# Altium project OSV.PrjPcb
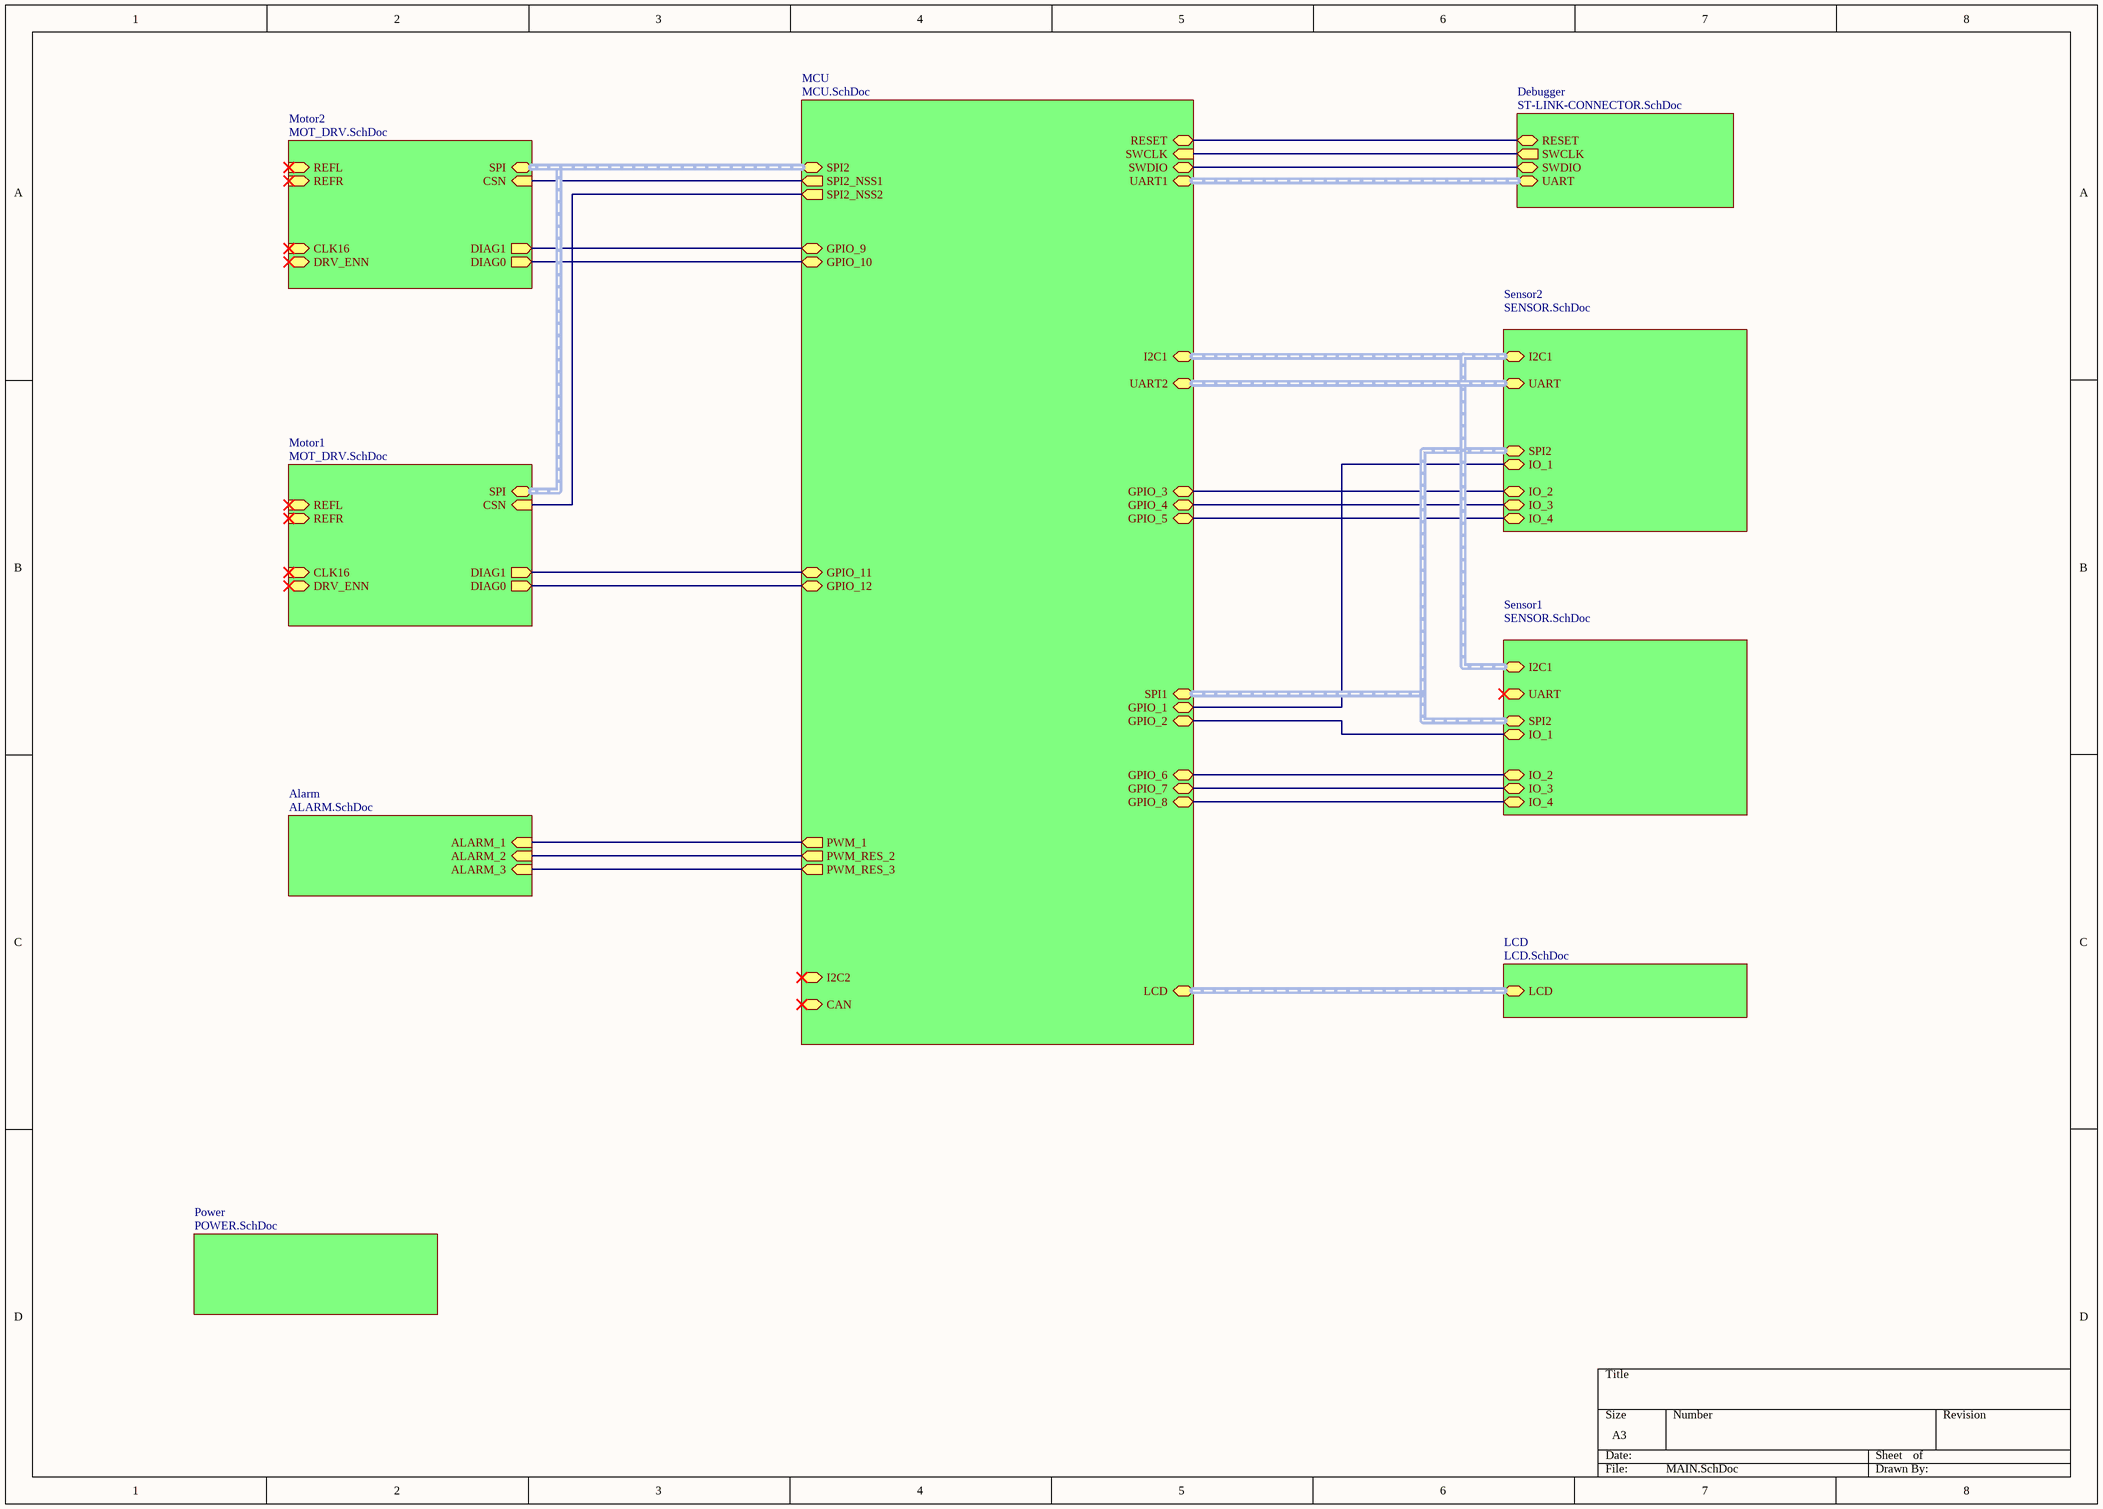
[diagram p0: MAIN.SchDoc]
8 sheets, 34 parts. Net scope: hierarchical (ports join the sheet entries above them; power ports are global).
Board file: MOTHERBOARD.PcbDoc
Sheets:
  MAIN.SchDoc
    MCU = MCU.SchDoc
    Motor2 = MOT_DRV.SchDoc
    Motor1 = MOT_DRV.SchDoc
    Alarm = ALARM.SchDoc
    LCD = LCD.SchDoc
    Debugger = ST-LINK-CONNECTOR.SchDoc
    Sensor1 = SENSOR.SchDoc
    Sensor2 = SENSOR.SchDoc
    Power = POWER.SchDoc

## Sheet MAIN.SchDoc
size A3

### Sub-sheets
Alarm = ALARM.SchDoc: ALARM_3 (in), ALARM_1 (in), ALARM_2 (in)
Debugger = ST-LINK-CONNECTOR.SchDoc: SWDIO (bidir), SWCLK (out), RESET, UART (harness UART)
LCD = LCD.SchDoc: LCD (harness LCD)
MCU = MCU.SchDoc: UART1 (harness UART), UART2 (harness UART), GPIO_7, CAN (harness CAN), GPIO_1, GPIO_5, RESET, SWCLK (in), GPIO_2, SWDIO (bidir), SPI2 (harness SPI), SPI1 (harness SPI), GPIO_6, GPIO_12, GPIO_3, GPIO_9, I2C1 (harness I2C), I2C2 (harness I2C), GPIO_11, LCD (harness LCD), GPIO_8, GPIO_4, GPIO_10, PWM_1 (out), PWM_RES_2 (out), PWM_RES_3 (out), SPI2_NSS1 (out), SPI2_NSS2 (out)
Motor1 = MOT_DRV.SchDoc: DRV_ENN, DIAG1 (out), REFR (in), DIAG0 (out), CLK16 (in), REFL (in), CSN (in), SPI (harness SPI)
Motor2 = MOT_DRV.SchDoc: DRV_ENN, DIAG1 (out), REFR (in), DIAG0 (out), CLK16 (in), REFL (in), CSN (in), SPI (harness SPI)
Power = POWER.SchDoc: no entries
Sensor1 = SENSOR.SchDoc: I2C1 (harness I2C), UART (harness UART), SPI2 (harness SPI), IO_2, IO_1, IO_3, IO_4
Sensor2 = SENSOR.SchDoc: I2C1 (harness I2C), UART (harness UART), SPI2 (harness SPI), IO_2, IO_1, IO_3, IO_4

### Nets
CSN: sheet MCU/SPI2_NSS1, sheet Motor2/CSN
CSN: sheet MCU/SPI2_NSS2, sheet Motor1/CSN  [a separate net that carries the same name]
DIAG0: sheet MCU/GPIO_12, sheet Motor1/DIAG0
DIAG0: sheet MCU/GPIO_10, sheet Motor2/DIAG0  [a separate net that carries the same name]
DIAG1: sheet MCU/GPIO_9, sheet Motor2/DIAG1
DIAG1: sheet MCU/GPIO_11, sheet Motor1/DIAG1  [a separate net that carries the same name]
GPIO_1: sheet MCU/GPIO_1, sheet Sensor2/IO_1
GPIO_2: sheet MCU/GPIO_2, sheet Sensor1/IO_1
GPIO_3: sheet MCU/GPIO_3, sheet Sensor2/IO_2
GPIO_4: sheet MCU/GPIO_4, sheet Sensor2/IO_3
GPIO_5: sheet MCU/GPIO_5, sheet Sensor2/IO_4
GPIO_6: sheet MCU/GPIO_6, sheet Sensor1/IO_2
GPIO_7: sheet MCU/GPIO_7, sheet Sensor1/IO_3
GPIO_8: sheet MCU/GPIO_8, sheet Sensor1/IO_4
NRST: sheet MCU/RESET, sheet Debugger/RESET
SWCLK: sheet MCU/SWCLK, sheet Debugger/SWCLK
SWDIO: sheet MCU/SWDIO, sheet Debugger/SWDIO
TIM1_CH1: sheet MCU/PWM_1, sheet Alarm/ALARM_1
TIM1_CH2: sheet MCU/PWM_RES_2, sheet Alarm/ALARM_2
TIM1_CH3: sheet MCU/PWM_RES_3, sheet Alarm/ALARM_3

### Buses and harness runs
harness sheet Debugger/UART = sheet MCU/UART1
harness sheet LCD/LCD = sheet MCU/LCD
harness sheet MCU/I2C1 = sheet Sensor1/I2C1 = sheet Sensor2/I2C1
harness sheet MCU/SPI1 = sheet Sensor1/SPI2 = sheet Sensor2/SPI2
harness sheet MCU/SPI2 = sheet Motor1/SPI = sheet Motor2/SPI
harness sheet MCU/UART2 = sheet Sensor2/UART

## Sheet MCU.SchDoc: MCU STM32H750VBT
size A3; Author: Ahmad Banshee; DrawnBy: Ahmad Banshee
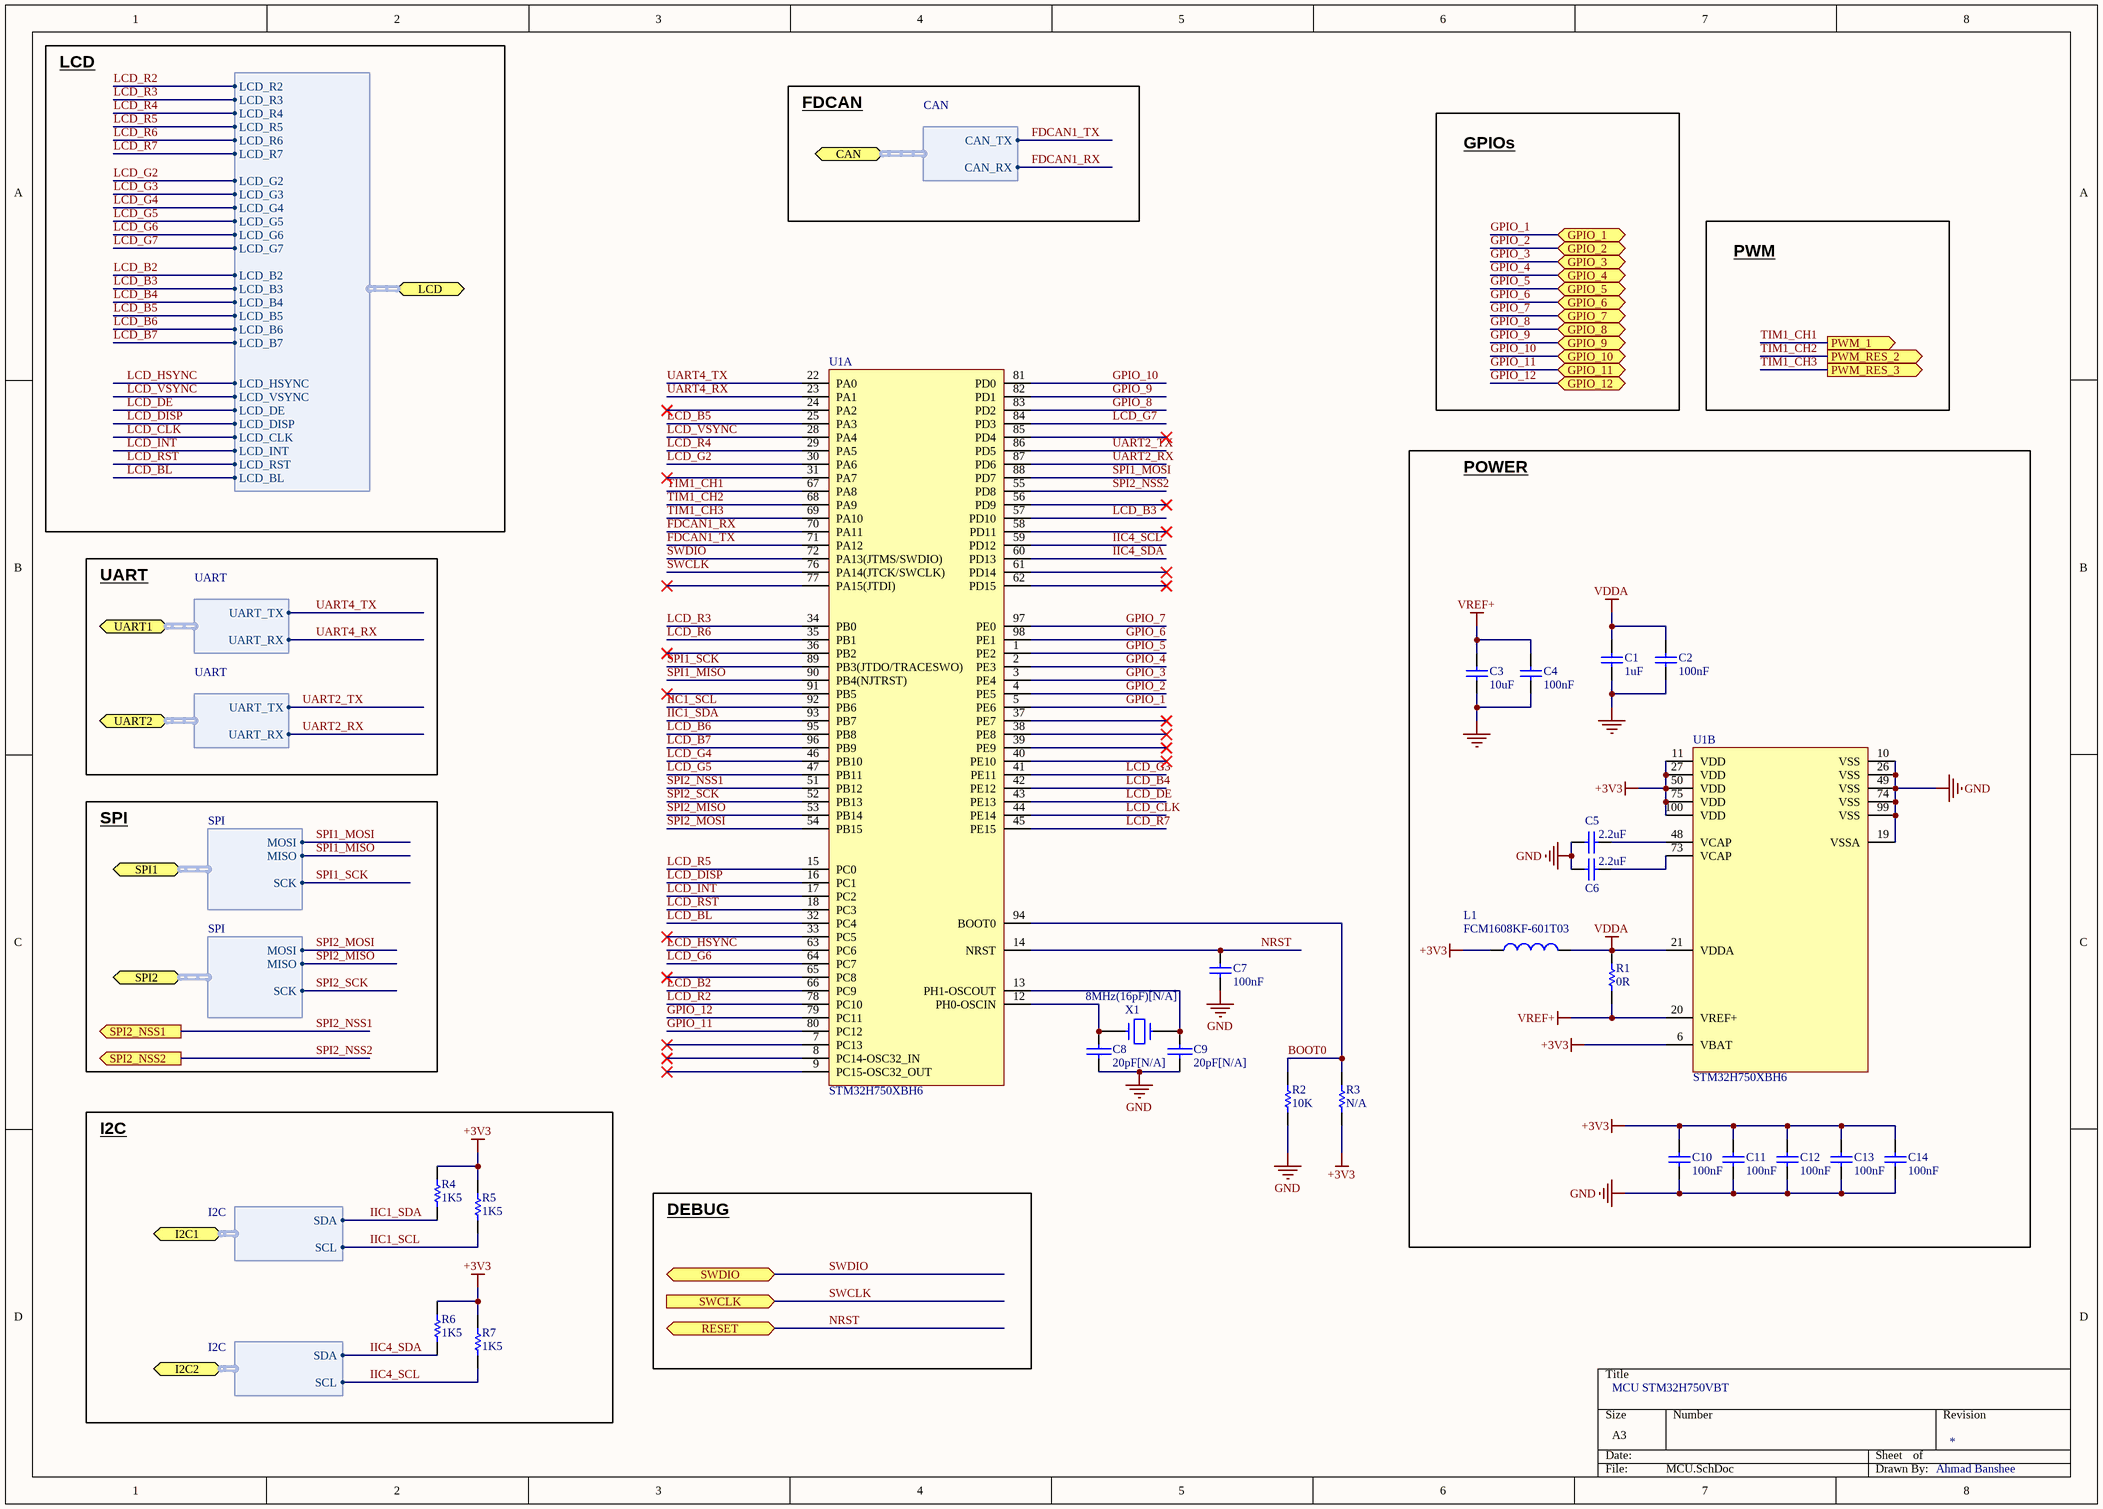
[diagram p1: MCU.SchDoc]

### Parts
C1  value 1uF  [0805C-ST]  (hidden comment: Capacitor)
C2  value 100nF  [0603C ST]  (hidden comment: Capacitor)
C3  value 10uF  [0805C-ST]  (hidden comment: Capacitor)
C4  value 100nF  [0603C ST]  (hidden comment: Capacitor)
C5  value 2.2uF  [0603C-ST]  (hidden comment: Capacitor)
C6  value 2.2uF  [0603C-ST]  (hidden comment: Capacitor)
C7  100nF  [0603C ST]
C8  20pF[N/A]  [0603C ST]
C9  20pF[N/A]  [0603C ST]
C10  value 100nF  [0603C ST]  (hidden comment: Capacitor)
C11  value 100nF  [0603C ST]  (hidden comment: Capacitor)
C12  value 100nF  [0603C ST]  (hidden comment: Capacitor)
C13  value 100nF  [0603C ST]  (hidden comment: Capacitor)
C14  value 100nF  [0603C ST]  (hidden comment: Capacitor)
L1  Manufacturer_Part_Number: FCM1608KF-601T03  [0603L-ST]  (hidden comment: BEAD)
R1  value 0R  [0603R]  (hidden comment: Resistor)
R2  value 10K  [0603R]  (hidden comment: Resistor)
R3  N/A  [0603R]
R4  value 1K5  [0603R]  (hidden comment: Resistor)
R5  value 1K5  [0603R]  (hidden comment: Resistor)
R6  value 1K5  [0603R]  (hidden comment: Resistor)
R7  value 1K5  [0603R]  (hidden comment: Resistor)
U1  value STM32H750XBH6  [LQFP100_M]  (parts A,B of 2)
X1  8MHz(16pF)[N/A]  [XTAL1]

### Blocks framed on the sheet
POWER: C1-C6 C10-C14 L1 R1 U1
I2C: R4-R7

### Ports
CAN (harness CAN), GPIO_1, GPIO_2, GPIO_3, GPIO_4, GPIO_5, GPIO_6, GPIO_7, GPIO_8, GPIO_9, GPIO_10, GPIO_11, GPIO_12, I2C1 (harness I2C), I2C2 (harness I2C), LCD (harness LCD), PWM_1 (out), PWM_RES_2 (out), PWM_RES_3 (out), RESET, SPI1 (harness SPI), SPI2 (harness SPI), SPI2_NSS1 (out), SPI2_NSS2 (out), SWCLK (in), SWDIO (bidir), UART1 (harness UART), UART2 (harness UART)

### Harnesses
I2C: SDA, SCL
UART: UART_TX, UART_RX
SPI: MOSI, MISO, SCK
CAN: CAN_TX, CAN_RX
LCD: LCD_R2, LCD_G2, LCD_B2, LCD_HSYNC, LCD_VSYNC, LCD_DE, LCD_DISP, LCD_CLK, LCD_INT, LCD_BL, LCD_RST, LCD_R3, LCD_R4, LCD_R5, LCD_R6, LCD_R7, LCD_G3, LCD_G4, LCD_G5, LCD_G6, LCD_G7, LCD_B3, LCD_B4, LCD_B5, LCD_B6, LCD_B7

### Nets
+3V3: C10.2 C11.2 C12.2 C13.2 C14.2 L1.1 R3.1 R4.2 R5.2 R6.2 R7.2 U1.6(VBAT) U1.11(VDD) U1.27(VDD) U1.50(VDD) U1.75(VDD) U1.100(VDD)
GND: C1.1 C2.1 C3.1 C4.1 C5.1 C6.1 C7.2 C8.1 C9.1 C10.1 C11.1 C12.1 C13.1 C14.1 R2.2 U1.10(VSS) U1.19(VSSA) U1.26(VSS) U1.49(VSS) U1.74(VSS) U1.99(VSS)
VDDA: C1.2 C2.2 L1.2 R1.1 U1.21(VDDA)
VREF+: C3.2 C4.2 R1.2 U1.20(VREF+)
BOOT0: R2.1 R3.2 U1.94(BOOT0)
FDCAN1_RX: U1.70(PA11) ; port CAN.CAN_RX
FDCAN1_TX: U1.71(PA12) ; port CAN.CAN_TX
GPIO_1: U1.5(PE6) ; port GPIO_1
GPIO_2: U1.4(PE5) ; port GPIO_2
GPIO_3: U1.3(PE4) ; port GPIO_3
GPIO_4: U1.2(PE3) ; port GPIO_4
GPIO_5: U1.1(PE2) ; port GPIO_5
GPIO_6: U1.98(PE1) ; port GPIO_6
GPIO_7: U1.97(PE0) ; port GPIO_7
GPIO_8: U1.83(PD2) ; port GPIO_8
GPIO_9: U1.82(PD1) ; port GPIO_9  [project net DIAG1]
GPIO_10: U1.81(PD0) ; port GPIO_10  [project net DIAG0]
GPIO_11: U1.80(PC12) ; port GPIO_11  [project net DIAG1]
GPIO_12: U1.79(PC11) ; port GPIO_12  [project net DIAG0]
IIC1_SCL: R5.1 U1.92(PB6) ; port I2C1.SCL
IIC1_SDA: R4.1 U1.93(PB7) ; port I2C1.SDA
IIC4_SCL: R7.1 U1.59(PD12) ; port I2C2.SCL
IIC4_SDA: R6.1 U1.60(PD13) ; port I2C2.SDA
LCD_B2: U1.66(PC9) ; port LCD.LCD_B2
LCD_B3: U1.57(PD10) ; port LCD.LCD_B3
LCD_B4: U1.42(PE12) ; port LCD.LCD_B4  [project net A_LCD]
LCD_B5: U1.25(PA3) ; port LCD.LCD_B5  [project net K_LCD]
LCD_B6: U1.95(PB8) ; port LCD.LCD_B6  [project net CANCEL]
LCD_B7: U1.96(PB9) ; port LCD.LCD_B7
LCD_BL: U1.32(PC4) ; port LCD.LCD_BL
LCD_CLK: U1.44(PE14) ; port LCD.LCD_CLK
LCD_DE: U1.43(PE13) ; port LCD.LCD_DE
LCD_DISP: U1.16(PC1) ; port LCD.LCD_DISP
LCD_G2: U1.30(PA6) ; port LCD.LCD_G2
LCD_G3: U1.41(PE11) ; port LCD.LCD_G3  [project net A0_LCD]
LCD_G4: U1.46(PB10) ; port LCD.LCD_G4
LCD_G5: U1.47(PB11) ; port LCD.LCD_G5  [project net CS_LCD]
LCD_G6: U1.64(PC7) ; port LCD.LCD_G6
LCD_G7: U1.84(PD3) ; port LCD.LCD_G7  [project net ADD]
LCD_HSYNC: U1.63(PC6) ; port LCD.LCD_HSYNC
LCD_INT: U1.17(PC2) ; port LCD.LCD_INT
LCD_R2: U1.78(PC10) ; port LCD.LCD_R2
LCD_R3: U1.34(PB0) ; port LCD.LCD_R3
LCD_R4: U1.29(PA5) ; port LCD.LCD_R4
LCD_R5: U1.15(PC0) ; port LCD.LCD_R5  [project net I:E]
LCD_R6: U1.35(PB1) ; port LCD.LCD_R6
LCD_R7: U1.45(PE15) ; port LCD.LCD_R7
LCD_RST: U1.18(PC3) ; port LCD.LCD_RST
LCD_VSYNC: U1.28(PA4) ; port LCD.LCD_VSYNC
NRST: C7.1 U1.14(NRST) ; port RESET
SPI1_MISO: U1.90(PB4(NJTRST)) ; port SPI1.MISO
SPI1_MOSI: U1.88(PD7) ; port SPI1.MOSI
SPI1_SCK: U1.89(PB3(JTDO/TRACESWO)) ; port SPI1.SCK
SPI2_MISO: U1.53(PB14) ; port SPI2.MISO  [project net SDO]
SPI2_MOSI: U1.54(PB15) ; port SPI2.MOSI  [project net SDI]
SPI2_NSS1: U1.51(PB12) ; port SPI2_NSS1  [project net CSN]
SPI2_NSS2: U1.55(PD8) ; port SPI2_NSS2  [project net CSN]
SPI2_SCK: U1.52(PB13) ; port SPI2.SCK  [project net SCK]
SWCLK: U1.76(PA14(JTCK/SWCLK)) ; port SWCLK
SWDIO: U1.72(PA13(JTMS/SWDIO)) ; port SWDIO
TIM1_CH1: U1.67(PA8) ; port PWM_1
TIM1_CH2: U1.68(PA9) ; port PWM_RES_2
TIM1_CH3: U1.69(PA10) ; port PWM_RES_3
UART2_RX: U1.87(PD6) ; port UART2.UART_RX
UART2_TX: U1.86(PD5) ; port UART2.UART_TX
UART4_RX: U1.23(PA1) ; port UART1.UART_RX
UART4_TX: U1.22(PA0) ; port UART1.UART_TX
NetC5_2: C5.2 U1.48(VCAP)
NetC6_2: C6.2 U1.73(VCAP)
NetC8_2: C8.2 U1.12(PH0-OSCIN) X1.1
NetC9_2: C9.2 U1.13(PH1-OSCOUT) X1.2

Not connected (* = marked no-connect by the designer): U1 7(PC13)* 8(PC14-OSC32_IN)* 9(PC15-OSC32_OUT)* 24(PA2)* 31(PA7)* 33(PC5)* 36(PB2)* 37(PE7)* 38(PE8)* 39(PE9)* 40(PE10)* 56(PD9)* 58(PD11)* 61(PD14)* 62(PD15)* 65(PC8)* 77(PA15(JTDI))* 85(PD4)* 91(PB5)*

### Notes on the sheet
- LCD
- FDCAN
- GPIOs
- PWM
- UART
- SPI
- DEBUG

### Library data of the parts
C1 C3 = MCD-00014: Capacitor, MLCC, 10uF, 25V, X5R, 10%, 0805, T=0,85mm; Manufacturer_Part_Number: CC0805KRX5R8BB106; Manufacturer: YAGEO; Provided_By: Subcon; Initial_Board_Reference: mb1274; Internal_Part_Number: MCD-00014; ECCN_US: n/a; ECCN_EU: n/a; ComponentLink1Description: Yageo_Capacitor_X5R-series.pdf; Status: Released; Part_Type: Capacitor; Package: C0805; ComponentLink1URL: http://tunmcdsvn.tun.st.com/Component_Datasheet_Library/Trunk/Capacitors/Yageo_Capacitor_X5R-series.pdf
C2 C4 C10-C14 = MCD-00102: Capacitor, MLCC, 100nF, 16V, X7R, 10%, 0402, T=0,5mm; Manufacturer_Part_Number: CC0402KRX7R7BB104; Manufacturer: YAGEO; Provided_By: Subcon; Initial_Board_Reference: MB1262; Internal_Part_Number: MCD-00102; Status: Released; Part_Type: Capacitor; Package: C0402; ComponentLink1Description: Yageo_Capacitor_X7R-series.pdf; ComponentLink1URL: http://tunmcdsvn.tun.st.com/Component_Datasheet_Library/Trunk/Capacitors/Yageo_Multilayer_Capacitor_X7R_series_100pF_to_22uF; ECCN_US: n/a; ECCN_EU: n/a
C5 C6 = MCD-00012: Capacitor, MLCC, 2.2uF, 10V, X5R, 10%, 0603, T=0,8mm; Manufacturer_Part_Number: CC0603KRX5R6BB225; Manufacturer: YAGEO; Alternate_Manufacturer_Part_Number: C0603C225K8PACTU; Alternate_Manufacturer: KEMET; Provided_By: Subcon; Initial_Board_Reference: MB1274; Internal_Part_Number: MCD-00012; Status: Released; Part_Type: Capacitor; Package: C0603; ComponentLink1Description: Yageo_Capacitor_X5R-series.pdf; ComponentLink1URL: http://tunmcdsvn.tun.st.com/Component_Datasheet_Library/Trunk/Capacitors/Yageo_Multilayer_capacitor_X5R_series_100pF_to_100uF; ECCN_US: n/a; ECCN_EU: n/a
C7 = Cap: Capacitor; Value: 10nF; Published: 8-Jun-2000; Revision: July-2002: Re-released for DXP Platform.; Publisher: Altium Limited
C8 C9 = CAP: Capacitor
L1 = MCD-00047: SMD Chip ferrite bead, 600R@100MHz +/-25%, 350mA, 500mohm DC, 0603, T=0.8mm; Part_Type: Inductor; Manufacturer: TAI-TECH; Provided_By: Subcon; Initial_Board_Reference: MB1274; Internal_Part_Number: MCD-00047; Value: 600R@100MHz; Status: Released; ComponentLink1Description: TaiTech_Bead_FCM1608_series.pdf; ComponentLink1URL: http://tunmcdsvn.tun.st.com/Component_Datasheet_Library/Trunk/Inductors/TaiTech_Bead_FCM1608_series; ECCN_US: n/a; ECCN_EU: n/a
R1 = MCD-00181: Resistor,0R,0603,ULO; Manufacturer_Part_Number: PMR03EZPJ000; Manufacturer: ROHM; Provided_By: Subcon; Internal_Part_Number: MCD-00181; Status: Released; Part_Type: Resistor; Package: R0603; ComponentLink1Description: ROHM_ULtra low Ohmic Resistor _PMR10EZPJ000.pdf; ComponentLink1URL: http://tunmcdsvn.tun.st.com/Component_Datasheet_Library/Trunk/Resistors/ROHM_ULtra low Ohmic Resistor _PMR10EZPJ000.pdf; ECCN_US: n/a; ECCN_EU: n/a
R2 R3 = MCD-00053: Resistor,10K,0402,1%,1/16W; Manufacturer_Part_Number: RC0402FR-0710KL; Manufacturer: YAGEO; Provided_By: subcon; Initial_Board_Reference: MB1274; Internal_Part_Number: MCD-00053; Status: Released; Part_Type: Resistor; Package: R0402; ComponentLink1Description: Yageo_Resistor_RC0402-series.pdf; ComponentLink1URL: http://tunmcdsvn.tun.st.com/Component_Datasheet_Library/Trunk/Resistors/Yageo_Resistor_RC0402-series; ECCN_US: n/a; ECCN_EU: n/a
  R3: Value: 10K
R4-R7 = MCD-00068: Resistor,1K5,0402,1%,1/16W; Manufacturer_Part_Number: RC0402FR-071K5L; Manufacturer: YAGEO; Provided_By: Subcon; Initial_Board_Reference: MB1274; Internal_Part_Number: MCD-00068; Status: Released; Part_Type: Resistor; Package: R0402; ComponentLink1Description: Datasheet; ComponentLink1URL: http://tunmcdsvn.tun.st.com/Component_Datasheet_Library/Trunk/Resistors/Yageo_Resistor_RC0402-series
U1 = STM32H750VBT: 32bit MCU TFBGA240+25; Internal_Part_Number: MCD-01085; Part_Type: IC; Manufacturer_Part_Number: STM32H745XIH6; Manufacturer: STMICROELECTRONICS; Provided_By: STM; Initial_Board_Reference: MB1381; Status: Footprint available; Package: TFBGA265; ComponentLink1Description: Datasheet; ComponentLink1URL: http://tunmcdsvn.tun.st.com/Component_Datasheet_Library/Trunk/IC/STM_MCU_STM32H745H6U_TFBGA265/STM_MCU_STM32H745H6U_TFBGA265.pdf
X1 = CRYSTAL

## Sheet MOT_DRV.SchDoc: MOT_DRV_PINOUT
size A; DrawnBy: Ahmad Banshee
Used 2 times, as channels Motor2, Motor1. Parts and nets are listed once, with the designators drawn on the sheet.
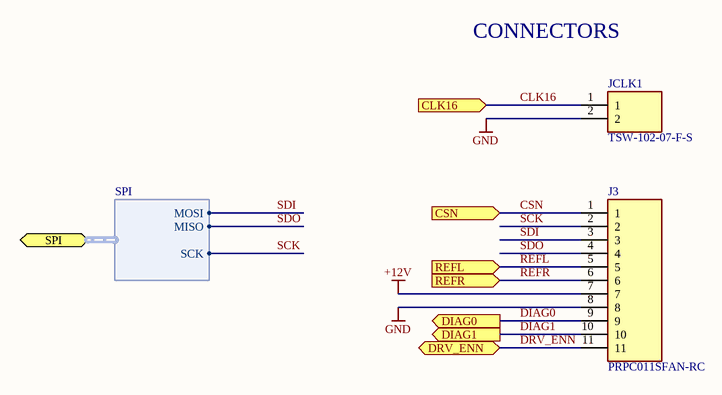
[diagram p2: MOT_DRV.SchDoc]

### Parts
J3  PRPC011SFAN-RC  [HDRV11W64P254_1X11_2794X254X1058P]
JCLK1  TSW-102-07-F-S  [HDRV2W64P254_1X2_508X241X838P]

### Ports
CLK16 (in), CSN (in), DIAG0 (out), DIAG1 (out), DRV_ENN, REFL (in), REFR (in), SPI (harness SPI)

### Harnesses
SPI: MOSI, MISO, SCK

### Nets
+12V: J3.7
GND: J3.8 JCLK1.2
CLK16: JCLK1.1 ; port CLK16
CSN: J3.1 ; port CSN
DIAG0: J3.9 ; port DIAG0
DIAG1: J3.10 ; port DIAG1
DRV_ENN: J3.11 ; port DRV_ENN
REFL: J3.5 ; port REFL
REFR: J3.6 ; port REFR
SCK: J3.2 ; port SPI.SCK
SDI: J3.3 ; port SPI.MOSI
SDO: J3.4 ; port SPI.MISO

### Channels
Motor2: designators end in _Motor2; ports CLK16=CLK16_Motor2 CSN=CSN DIAG0=DIAG0 DIAG1=DIAG1 DRV_ENN=DRV_ENN_Motor2 REFL=REFL_Motor2 REFR=REFR_Motor2
Motor1: designators end in _Motor1; ports CLK16=CLK16_Motor1 CSN=CSN DIAG0=DIAG0 DIAG1=DIAG1 DRV_ENN=DRV_ENN_Motor1 REFL=REFL_Motor1 REFR=REFR_Motor1

### Notes on the sheet
- CONNECTORS

### Library data of the parts
J3 = PRPC011SFAN-RC: Connector; Manufacturer_Name: Sullins; Datasheet Link: https://media.digikey.com/PDF/Data%20Sheets/Sullins%20PDFs/xRxCzzzSxxN-RC_ST_11635-B.pdf; Height: 10.58mm; Manufacturer_Part_Number: PRPC011SFAN-RC
JCLK1 = TSW-102-07-F-S: Connector; Manufacturer_Name: SAMTEC; Datasheet Link: http://suddendocs.samtec.com/catalog_english/tsw_th.pdf; Height: 8.38mm; Manufacturer_Part_Number: TSW-102-07-F-S; Mouser Part Number: 200-TSW10207FS; Mouser Price/Stock: https://www.mouser.com/Search/Refine.aspx?Keyword=200-TSW10207FS; RS Part Number: 1557967; RS Price/Stock: http://uk.rs-online.com/web/p/products/1557967

## Sheet ALARM.SchDoc
size A
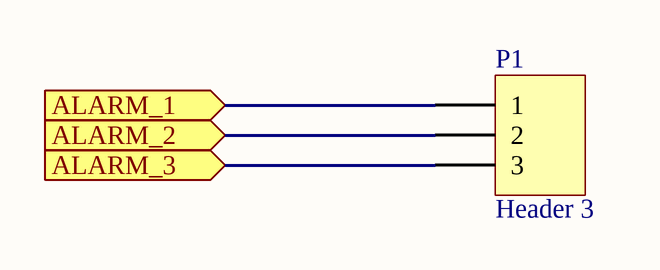
[diagram p3: ALARM.SchDoc]

### Parts
P1  Header 3  [HDR1X3]  (no BOM)

### Ports
ALARM_1 (in), ALARM_2 (in), ALARM_3 (in)

### Nets
TIM1_CH1: P1.1 ; port ALARM_1
TIM1_CH2: P1.2 ; port ALARM_2
TIM1_CH3: P1.3 ; port ALARM_3

### Library data of the parts
P1 = Header 3: Header, 3-Pin; LatestRevisionDate: 17-Jul-2002; LatestRevisionNote: Re-released for DXP Platform.; Publisher: Altium Limited

## Sheet LCD.SchDoc
size A
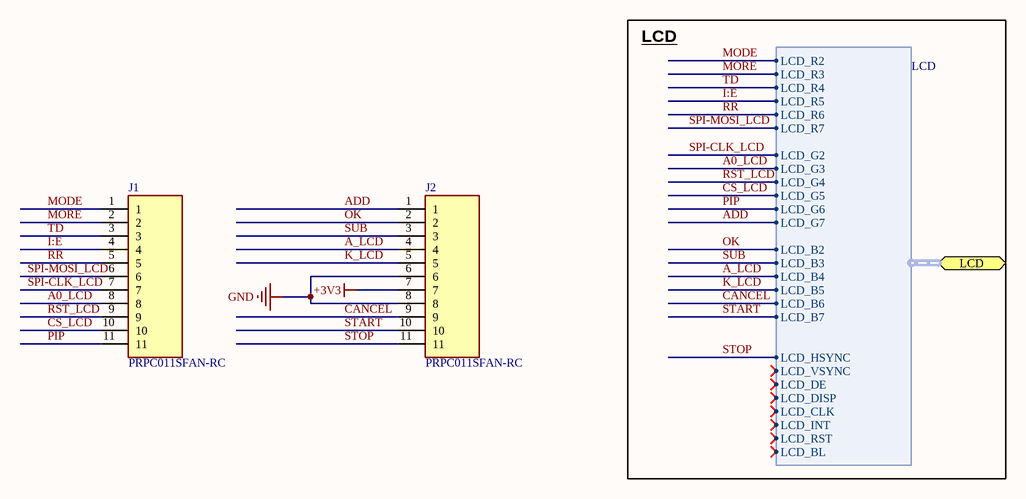
[diagram p4: LCD.SchDoc]

### Parts
J1  PRPC011SFAN-RC  [1N4148]
J2  PRPC011SFAN-RC  [HDRV11W64P254_1X11_2794X254X1058P]

### Ports
LCD (harness LCD)

### Harnesses
LCD: LCD_R2, LCD_G2, LCD_B2, LCD_HSYNC, LCD_VSYNC, LCD_DE, LCD_DISP, LCD_CLK, LCD_INT, LCD_BL, LCD_RST, LCD_R3, LCD_R4, LCD_R5, LCD_R6, LCD_R7, LCD_G3, LCD_G4, LCD_G5, LCD_G6, LCD_G7, LCD_B3, LCD_B4, LCD_B5, LCD_B6, LCD_B7

### Nets
+3V3: J2.7
GND: J2.6 J2.8
A0_LCD: J1.8 ; port LCD.LCD_G3
A_LCD: J2.4 ; port LCD.LCD_B4
ADD: J2.1 ; port LCD.LCD_G7
CANCEL: J2.9 ; port LCD.LCD_B6
CS_LCD: J1.10 ; port LCD.LCD_G5
I:E: J1.4 ; port LCD.LCD_R5
K_LCD: J2.5 ; port LCD.LCD_B5
MODE: J1.1 ; port LCD.LCD_R2  [project net LCD_R2]
MORE: J1.2 ; port LCD.LCD_R3  [project net LCD_R3]
OK: J2.2 ; port LCD.LCD_B2  [project net LCD_B2]
PIP: J1.11 ; port LCD.LCD_G6  [project net LCD_G6]
RR: J1.5 ; port LCD.LCD_R6  [project net LCD_R6]
RST_LCD: J1.9 ; port LCD.LCD_G4  [project net LCD_G4]
SPI-CLK_LCD: J1.7 ; port LCD.LCD_G2  [project net LCD_G2]
SPI-MOSI_LCD: J1.6 ; port LCD.LCD_R7  [project net LCD_R7]
START: J2.10 ; port LCD.LCD_B7  [project net LCD_B7]
STOP: J2.11 ; port LCD.LCD_HSYNC  [project net LCD_HSYNC]
SUB: J2.3 ; port LCD.LCD_B3  [project net LCD_B3]
TD: J1.3 ; port LCD.LCD_R4  [project net LCD_R4]

### Notes on the sheet
- LCD

### Library data of the parts
J1 J2 = PRPC011SFAN-RC: Connector; Manufacturer_Name: Sullins; Datasheet Link: https://media.digikey.com/PDF/Data%20Sheets/Sullins%20PDFs/xRxCzzzSxxN-RC_ST_11635-B.pdf; Height: 10.58mm; Manufacturer_Part_Number: PRPC011SFAN-RC

## Sheet ST-LINK-CONNECTOR.SchDoc
size A
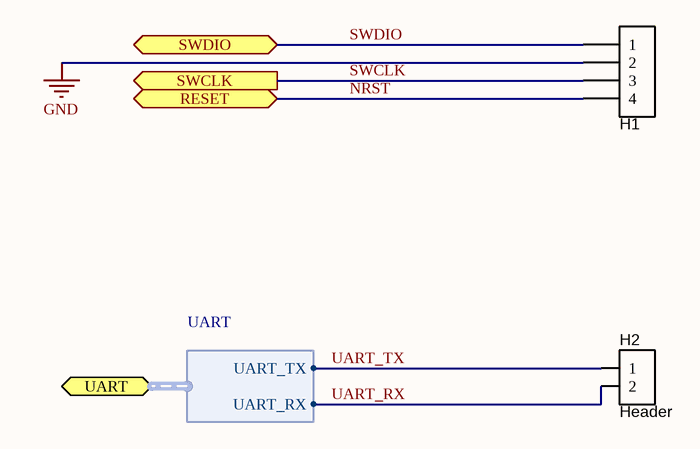
[diagram p5: ST-LINK-CONNECTOR.SchDoc]

### Parts
H1  Programmer  [HDR1X4_2.54MMP]  (value not drawn)  (no BOM)
H2  Header  [HDR1X2]  (no BOM)

### Ports
RESET, SWCLK (out), SWDIO (bidir), UART (harness UART)

### Harnesses
UART: UART_TX, UART_RX

### Nets
GND: H1.2
NRST: H1.4 ; port RESET
SWCLK: H1.3 ; port SWCLK
SWDIO: H1.1 ; port SWDIO
UART_RX: H2.2 ; port UART.UART_RX  [project net UART4_RX]
UART_TX: H2.1 ; port UART.UART_TX  [project net UART4_TX]

### Library data of the parts
H1 = Header4P_1: Header 4-pin
H2 = Header2P: Header, 2-pin

## Sheet SENSOR.SchDoc
size A
Used 2 times, as channels Sensor1, Sensor2. Parts and nets are listed once, with the designators drawn on the sheet.
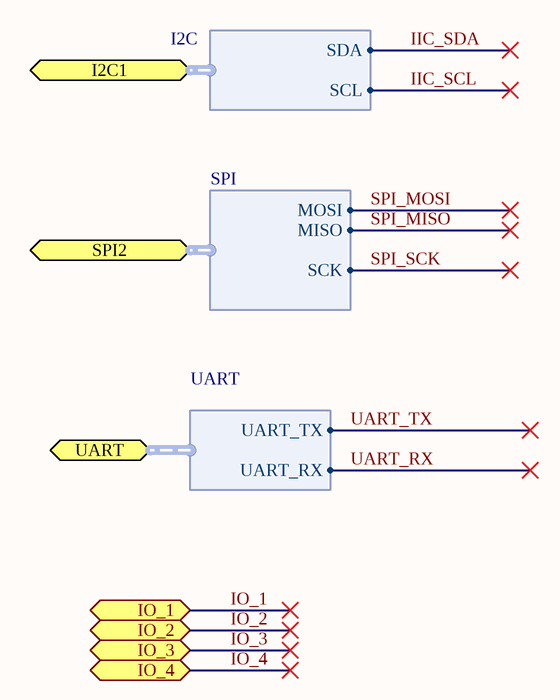
[diagram p6: SENSOR.SchDoc]

### Ports
I2C1 (harness I2C), IO_1, IO_2, IO_3, IO_4, SPI2 (harness SPI), UART (harness UART)

### Harnesses
I2C: SDA, SCL
SPI: MOSI, MISO, SCK
UART: UART_TX, UART_RX

### Channels
Sensor1: ports IO_1=GPIO_2 IO_2=GPIO_6 IO_3=GPIO_7 IO_4=GPIO_8
Sensor2: ports IO_1=GPIO_1 IO_2=GPIO_3 IO_3=GPIO_4 IO_4=GPIO_5

## Sheet POWER.SchDoc
size A
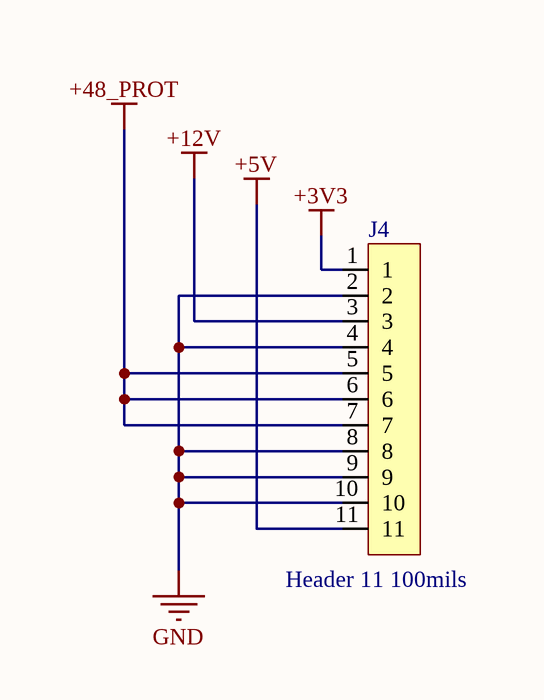
[diagram p7: POWER.SchDoc]

### Parts
J4  Header 11 100mils  [Header 11 pos Male 2.54]

### Nets
+3V3: J4.1
+5V: J4.11
+12V: J4.3
+48_PROT: J4.5 J4.6 J4.7
GND: J4.2 J4.4 J4.8 J4.9 J4.10

### Library data of the parts
J4 = PREC011SAAN-RC: HEADER 11 pins Male 2.54MM; Manufacturer: Sullins; Number of Positions: 11; Connector Type: Male Pin; Pitch: 0.1inch; Supplier 1: Digi-Key; Manufacturer Part Number: PREC011SAAN-RC; RoHS: Yes; Category: Connectors; Stock 1: 2584; Pricing 1: 1=0,26000, 10=0,24500, 25=0,20920, 50=0,18300, 100=0,16990, 250=0,15028, 500=0,14374 (USD); Mount: Through Hole; Contact Plating: Tin; Color: Black; Package Quantity: 1; Number of Rows: 1; Packaging: Bulk; Termination: Solder; Contact Mating Length: 0.23inch; ComponentLink1URL: https://datasheet.ciiva.com/740/zrzczzzszzn-rc-st-11635-b-740834.pdf?src-supplier=Digi-Key; ComponentLink1Description: https://datasheet.ciiva.com/740/zrzczzzszzn-rc-st-11635-b-740834.pdf?src-supplier=Digi-Key; Supplier Part Number 1: S1012EC-11-ND

## Nets that join several sheets
+3V3: MCU (17 pins), LCD (J2.7), POWER (J4.1)
+12V: Motor2 (J3_Motor2.7), Motor1 (J3_Motor1.7), POWER (J4.3)
GND: MCU (21 pins), Motor2 (J3_Motor2.8 JCLK1_Motor2.2), Motor1 (J3_Motor1.8 JCLK1_Motor1.2), LCD (J2.6 J2.8), ST-LINK-CONNECTOR (H1.2), POWER (5 pins)
A0_LCD: MCU (U1.41), LCD (J1.8)
A_LCD: MCU (U1.42), LCD (J2.4)
ADD: MCU (U1.84), LCD (J2.1)
CANCEL: MCU (U1.95), LCD (J2.9)
CS_LCD: MCU (U1.47), LCD (J1.10)
CSN: MCU (U1.51), Motor2 (J3_Motor2.1)
CSN: MCU (U1.55), Motor1 (J3_Motor1.1)
DIAG0: MCU (U1.79), Motor1 (J3_Motor1.9)
DIAG0: MCU (U1.81), Motor2 (J3_Motor2.9)
DIAG1: MCU (U1.82), Motor2 (J3_Motor2.10)
DIAG1: MCU (U1.80), Motor1 (J3_Motor1.10)
I:E: MCU (U1.15), LCD (J1.4)
K_LCD: MCU (U1.25), LCD (J2.5)
LCD_B2: MCU (U1.66), LCD (J2.2)
LCD_B3: MCU (U1.57), LCD (J2.3)
LCD_B7: MCU (U1.96), LCD (J2.10)
LCD_G2: MCU (U1.30), LCD (J1.7)
LCD_G4: MCU (U1.46), LCD (J1.9)
LCD_G6: MCU (U1.64), LCD (J1.11)
LCD_HSYNC: MCU (U1.63), LCD (J2.11)
LCD_R2: MCU (U1.78), LCD (J1.1)
LCD_R3: MCU (U1.34), LCD (J1.2)
LCD_R4: MCU (U1.29), LCD (J1.3)
LCD_R6: MCU (U1.35), LCD (J1.5)
LCD_R7: MCU (U1.45), LCD (J1.6)
NRST: MCU (C7.1 U1.14), ST-LINK-CONNECTOR (H1.4)
SCK: MCU (U1.52), Motor2 (J3_Motor2.2), Motor1 (J3_Motor1.2)
SDI: MCU (U1.54), Motor2 (J3_Motor2.3), Motor1 (J3_Motor1.3)
SDO: MCU (U1.53), Motor2 (J3_Motor2.4), Motor1 (J3_Motor1.4)
SWCLK: MCU (U1.76), ST-LINK-CONNECTOR (H1.3)
SWDIO: MCU (U1.72), ST-LINK-CONNECTOR (H1.1)
TIM1_CH1: MCU (U1.67), ALARM (P1.1)
TIM1_CH2: MCU (U1.68), ALARM (P1.2)
TIM1_CH3: MCU (U1.69), ALARM (P1.3)
UART4_RX: MCU (U1.23), ST-LINK-CONNECTOR (H2.2)
UART4_TX: MCU (U1.22), ST-LINK-CONNECTOR (H2.1)